# EAGLE design quadcopter (EAGLE 9.7.0)
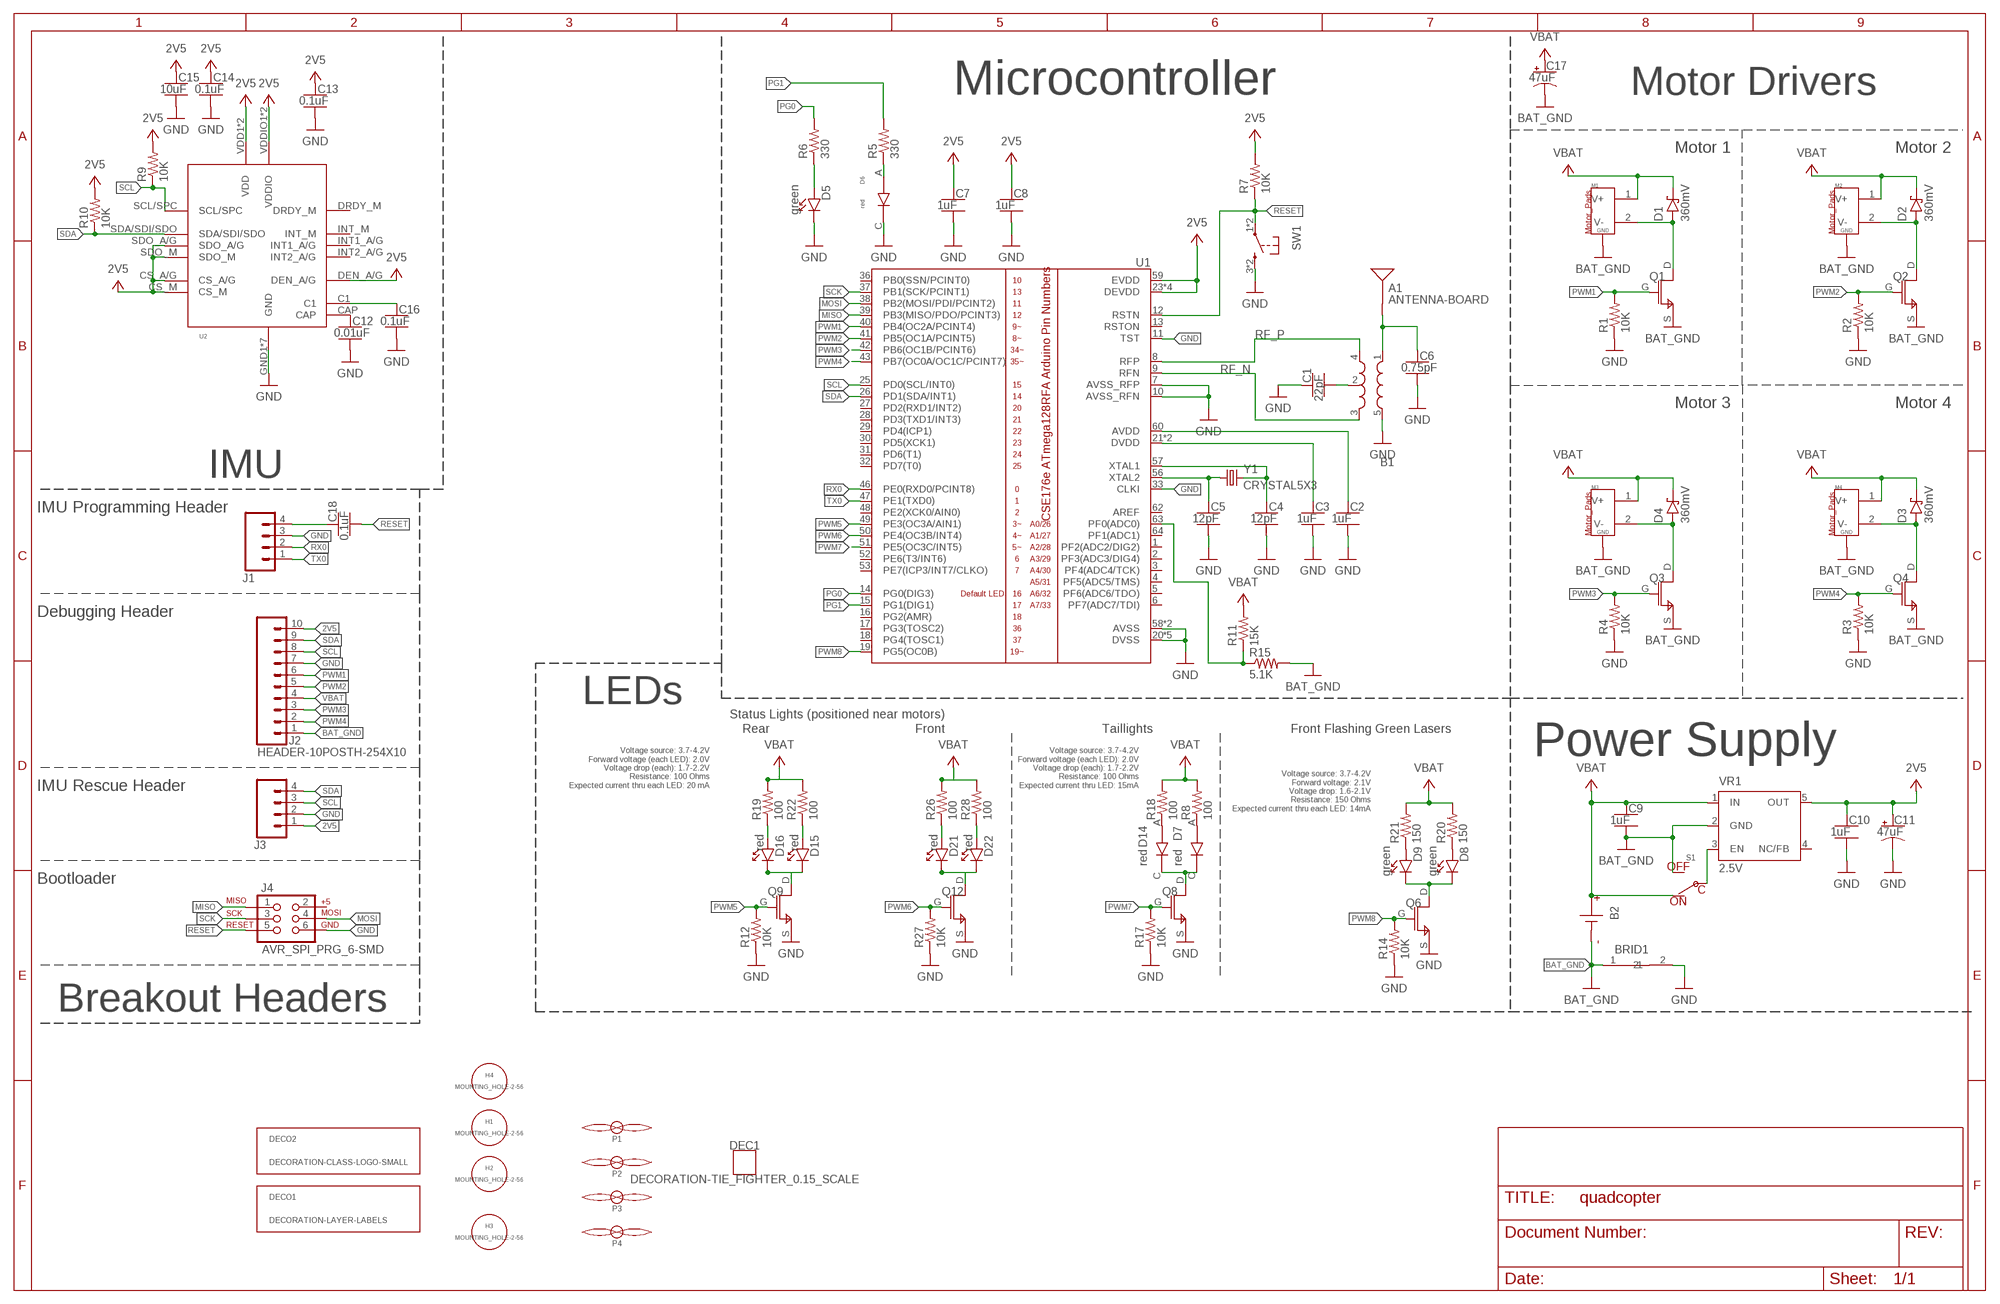
[diagram p0: schematic, sheet 1]
FRAME1 (FRAME_B_L): CREATOR: Unknown; DIST: Unknown; DISTPN: Unknown

## Parts
A1  ANTENNA-BOARD  [ANT_PCB_2.4GHZ_NRF8001_1.6MM_1OZ]
B1  BALUN0805  [BALUN]
B2  BATTERY-SMD-TH  [BATTERY-COMBO]
BRID1  NET_BRIDGE_5X5  [NET_BRIDGE_5X5]
C1  22pF  CAPACITOR-NP_SMD-2012-0805_CERAMIC-22PF  [CAPC2012X140_HS]
C2  1uF  CAPACITOR-NP_SMD-2012-0805_CERAMIC-1UF  [CAPC2012X140_HS]
C3  1uF  CAPACITOR-NP_SMD-2012-0805_CERAMIC-1UF  [CAPC2012X140_HS]
C4  12pF  CAPACITOR-NP_SMD-2012-0805_CERAMIC-12PF  [CAPC2012X140_HS]
C5  12pF  CAPACITOR-NP_SMD-2012-0805_CERAMIC-12PF  [CAPC2012X140_HS]
C6  0.75pF  CAPACITOR-NP_SMD-2012-0805_CERAMIC-0.75PF  [CAPC2012X140_HS]
C7  1uF  CAPACITOR-NP_SMD-2012-0805_CERAMIC-1UF  [CAPC2012X140_HS]
C8  1uF  CAPACITOR-NP_SMD-2012-0805_CERAMIC-1UF  [CAPC2012X140_HS]
C9  1uF  CAPACITOR-NP_SMD-2012-0805_CERAMIC-1UF  [CAPC2012X140_HS]
C10  1uF  CAPACITOR-NP_SMD-2012-0805_CERAMIC-1UF  [CAPC2012X140_HS]
C11  47uF  CAPACITOR-POL_47UF-SMD-1206-TAJA  [CAPMP3216X180]
C12  0.01uF  CAPACITOR-NP_SMD-2012-0805_CERAMIC-0.01UF  [CAPC2012X140_HS]
C13  0.1uF  CAPACITOR-NP_SMD-2012-0805_CERAMIC-0.1UF  [CAPC2012X140_HS]
C14  0.1uF  CAPACITOR-NP_SMD-2012-0805_CERAMIC-0.1UF  [CAPC2012X140_HS]
C15  10uF  CAPACITOR-NP_SMD-2012-0805_CERAMIC-10UF  [CAPC2012X140_HS]
C16  0.1uF  CAPACITOR-NP_SMD-2012-0805_CERAMIC-0.1UF  [CAPC2012X140_HS]
C17  47uF  CAPACITOR-POL_47UF-SMD-1206-TAJA  [CAPMP3216X180]
C18  0.1uF  CAPACITOR-NP_SMD-2012-0805_CERAMIC-0.1UF  [CAPC2012X140_HS]
D1  360mV  DIODE-SCHOTTKY_-SMD-SOD123  [SODFL3516X96]
D2  360mV  DIODE-SCHOTTKY_-SMD-SOD123  [SODFL3516X96]
D3  360mV  DIODE-SCHOTTKY_-SMD-SOD123  [SODFL3516X96]
D4  360mV  DIODE-SCHOTTKY_-SMD-SOD123  [SODFL3516X96]
D5  green  DIODE-LED_SMD-2012-0805-GREEN  [LEDSC125X200X120-2_HS]
D6  red  LED_RED-LTST-C170EKT  [LTST-C170EKT]
D7  red  LED_RED-LTST-C170EKT  [LTST-C170EKT]
D8  green  DIODE-LED_SMD-2012-0805-GREEN  [LEDSC125X200X120-2_HS]
D9  green  DIODE-LED_SMD-2012-0805-GREEN  [LEDSC125X200X120-2_HS]
D14  red  LED_RED-LTST-C170EKT  [LTST-C170EKT]
D15  red  LED-350-2312-1-ND-REVERSE  [1206_LED_REVERSE]
D16  red  LED-350-2312-1-ND-REVERSE  [1206_LED_REVERSE]
D21  red  LED-350-2312-1-ND-REVERSE  [1206_LED_REVERSE]
D22  red  LED-350-2312-1-ND-REVERSE  [1206_LED_REVERSE]
DEC1  DECORATION-TIE_FIGHTER_0.15_SCALE  [TIE_FIGHTER_0.15_SCALE]
DECO1  DECORATION-LAYER-LABELS  [LAYER_LABELS]
DECO2  DECORATION-CLASS-LOGO-SMALL  [QUADCLASS_LOGO_SMALL]
H1  MOUNTING_HOLE-2-56  [2-56-MOUNTING-HOLE-NO-METAL]
H2  MOUNTING_HOLE-2-56  [2-56-MOUNTING-HOLE-NO-METAL]
H3  MOUNTING_HOLE-2-56  [2-56-MOUNTING-HOLE-NO-METAL]
H4  MOUNTING_HOLE-2-56  [2-56-MOUNTING-HOLE-NO-METAL]
J1  HEADER-4POS-0.1IN-FEMALE-SMD-BOTTOM-ENTRY  [HEADER-1X4-BOTTOM-ENTRY]
J2  HEADER-10POSTH-254X10  [HDRV10W63P254_10X1_2540X254H838_HS]
J3  HEADER-4POS-0.1IN-FEMALE  [HDRVR4W80P254_1X4_1066X254X850B]
J4  AVR_SPI_PRG_6-SMD  [2X3-SMD]
M1  MOTOR_PADS_GND-MOLEX-SMD  [MOLEX-0532610271]
M2  MOTOR_PADS_GND-MOLEX-SMD  [MOLEX-0532610271]
M3  MOTOR_PADS_GND-MOLEX-SMD  [MOLEX-0532610271]
M4  MOTOR_PADS_GND-MOLEX-SMD  [MOLEX-0532610271]
P1  PROPELLOR-45MM  [MOTOR_AND_PROP]
P2  PROPELLOR-45MM  [MOTOR_AND_PROP]
P3  PROPELLOR-45MM  [MOTOR_AND_PROP]
P4  PROPELLOR-45MM  [MOTOR_AND_PROP]
Q1  N-MOSFET-SI2302DS  [SI2302DS]
Q2  N-MOSFET-SI2302DS  [SI2302DS]
Q3  N-MOSFET-SI2302DS  [SI2302DS]
Q4  N-MOSFET-SI2302DS  [SI2302DS]
Q6  N-MOSFET-SI2302DS  [SI2302DS]
Q8  N-MOSFET-SI2302DS  [SI2302DS]
Q9  N-MOSFET-SI2302DS  [SI2302DS]
Q12  N-MOSFET-SI2302DS  [SI2302DS]
R1  10K  RESISTOR_SMD-2012-0805-10K  [RESC2012X60_HS]
R2  10K  RESISTOR_SMD-2012-0805-10K  [RESC2012X60_HS]
R3  10K  RESISTOR_SMD-2012-0805-10K  [RESC2012X60_HS]
R4  10K  RESISTOR_SMD-2012-0805-10K  [RESC2012X60_HS]
R5  330  RESISTOR_SMD-2012-0805-330  [RESC2012X60_HS]
R6  330  RESISTOR_SMD-2012-0805-330  [RESC2012X60_HS]
R7  10K  RESISTOR_SMD-2012-0805-10K  [RESC2012X60_HS]
R8  100  RESISTOR_SMD-2012-0805-100  [RESC2012X60_HS]
R9  10K  RESISTOR_SMD-2012-0805-10K  [RESC2012X60_HS]
R10  10K  RESISTOR_SMD-2012-0805-10K  [RESC2012X60_HS]
R11  15K  RESISTOR_SMD-2012-0805-15K  [RESC2012X60_HS]
R12  10K  RESISTOR_SMD-2012-0805-10K  [RESC2012X60_HS]
R14  10K  RESISTOR_SMD-2012-0805-10K  [RESC2012X60_HS]
R15  5.1K  RESISTOR_SMD-2012-0805-5.1K  [RESC2012X60_HS]
R17  10K  RESISTOR_SMD-2012-0805-10K  [RESC2012X60_HS]
R18  100  RESISTOR_SMD-2012-0805-100  [RESC2012X60_HS]
R19  100  RESISTOR_SMD-2012-0805-100  [RESC2012X60_HS]
R20  150  RESISTOR_SMD-2012-0805-150  [RESC2012X60_HS]
R21  150  RESISTOR_SMD-2012-0805-150  [RESC2012X60_HS]
R22  100  RESISTOR_SMD-2012-0805-100  [RESC2012X60_HS]
R26  100  RESISTOR_SMD-2012-0805-100  [RESC2012X60_HS]
R27  10K  RESISTOR_SMD-2012-0805-10K  [RESC2012X60_HS]
R28  100  RESISTOR_SMD-2012-0805-100  [RESC2012X60_HS]
S1  POWER-SWITCH-MFS201N-9-Z-SMD-EDGE  [JS102011SAQN]
SW1  PUSHBUTTON_-4.5X4.5  [4.5MM_TACTILE_SWITCH_TL3305AF160QG]
U1  ATMEGA128RFA1  [QFN-64]
U2  IMU_LSM9DS1-LSM9DS1  [LSM9DS1]
VR1  2.5V  TPS73633-DBVT2.5V  [SOT23-DBV]
Y1  CRYSTAL5X3  [CRYSTAL-SMD-5X3]

## Nets
2V5 [PWR]: C7.1 C8.1 C10.1 C11.1(+) C13.1 C14.1 C15.1 J2.10 J3.1 R7.2 R9.2 R10.2 U1.23(DEVDD) U1.34(DEVDD) U1.44(DEVDD) U1.54(DEVDD) U1.59(EVDD) U2.CS_A/G U2.CS_M U2.DEN_A/G U2.SDO_A/G U2.SDO_M U2.VDD1(VDD) U2.VDD2(VDD) U2.VDDIO1(VDDIO) U2.VDDIO2(VDDIO) VR1.5(OUT)
ANTENNA [RFSIG]: A1.FEED(SIGNAL) B1.1(IN) C6.1
BAT_GND [HIGHCURRENT]: B2.2(N) B2.G2(N) B2.G3(N) B2.G(N) BRID1.1 C9.2 C17.2(-) J2.1 M1.G1(GND) M1.G2(GND) M2.G1(GND) M2.G2(GND) M3.G1(GND) M3.G2(GND) M4.G1(GND) M4.G2(GND) Q1.S Q2.S Q3.S Q4.S R15.2 S1.A(OFF) VR1.2(GND)
GND [PWR]: B1.5(GND) BRID1.2 C1.1 C2.2 C3.2 C4.2 C5.2 C6.2 C7.2 C8.2 C10.2 C11.2(-) C12.2 C13.2 C14.2 C15.2 C16.2 D5.C D6.C J1.3 J2.7 J3.2 J4.6 Q6.S Q8.S Q9.S Q12.S R1.1 R2.1 R3.1 R4.1 R12.1 R14.1 R17.1 R27.1 SW1.3 SW1.4 U1.7(AVSS_RFP) U1.10(AVSS_RFN) U1.11(TST) U1.20(DVSS) U1.24(DVSS) U1.33(CLKI) U1.35(DVSS) U1.45(DVSS) U1.55(DVSS) U1.58(AVSS) U1.61(AVSS) U2.GND1(GND) U2.GND2(GND) U2.RES1(GND) U2.RES2(GND) U2.RES3(GND) U2.RES4(GND) U2.RES5(GND)
MISO: J4.1 U1.39(PB3(MISO/PDO/PCINT3))
MOSI: J4.4 U1.38(PB2(MOSI/PDI/PCINT2))
N$1 [HIGHCURRENT]: D2.2(A) M2.2(V-) Q2.D
N$2 [HIGHCURRENT]: D1.2(A) M1.2(V-) Q1.D
N$3 [HIGHCURRENT]: D4.2(A) M3.2(V-) Q3.D
N$4 [HIGHCURRENT]: D3.2(A) M4.2(V-) Q4.D
N$5: D6.A R5.1
N$6: C18.1 J1.4
N$7: B1.2(GND) C1.2
N$8: C2.1 U1.60(AVDD)
N$9: C3.1 U1.21(DVDD) U1.22(DVDD)
N$10: C5.1 U1.56(XTAL2) Y1.1
N$11: C4.1 U1.57(XTAL1) Y1.3
N$13: D5.A R6.1
N$16: C12.1 U2.CAP
N$17: D8.C D9.C Q6.D
N$18: D14.A R18.1
N$19: D8.A R20.1
N$20: D9.A R21.1
N$21: D7.A R8.1
N$22: C16.1 U2.C1
N$23: S1.C VR1.3(EN)
N$26: D16.2(A) R19.1
N$27: D7.C D14.C Q8.D
N$28: R11.1 R15.1 U1.63(PF0(ADC0))
N$34: D15.2(A) R22.1
N$35: D15.1(C) D16.1(C) Q9.D
N$40: D21.1(C) D22.1(C) Q12.D
N$42: D21.2(A) R26.1
N$43: D22.2(A) R28.1
PG0: R6.2 U1.14(PG0(DIG3))
PG1: R5.2 U1.15(PG1(DIG1))
PWM1: J2.6 Q1.G R1.2 U1.40(PB4(OC2A/PCINT4))
PWM2: J2.5 Q2.G R2.2 U1.41(PB5(OC1A/PCINT5))
PWM3: J2.3 Q3.G R4.2 U1.42(PB6(OC1B/PCINT6))
PWM4: J2.2 Q4.G R3.2 U1.43(PB7(OC0A/OC1C/PCINT7))
PWM5: Q9.G R12.2 U1.49(PE3(OC3A/AIN1))
PWM6: Q12.G R27.2 U1.50(PE4(OC3B/INT4))
PWM7: Q8.G R17.2 U1.51(PE5(OC3C/INT5))
PWM8: Q6.G R14.2 U1.19(PG5(OC0B))
RESET: C18.2 J4.5 R7.1 SW1.1 SW1.2 U1.12(RSTN)
RF_N: B1.3(OUT2) U1.9(RFN)
RF_P: B1.4(OUT1) U1.8(RFP)
RX0: J1.2 U1.46(PE0(RXD0/PCINT8))
SCK: J4.3 U1.37(PB1(SCK/PCINT1))
SCL: J2.8 J3.3 R9.1 U1.25(PD0(SCL/INT0)) U2.SCL/SPC
SDA: J2.9 J3.4 R10.1 U1.26(PD1(SDA/INT1)) U2.SDA/SDI/SDO
TX0: J1.1 U1.47(PE1(TXD0))
VBAT [HIGHCURRENT]: B2.1(P) B2.P C9.1 C17.1(+) D1.1(C) D2.1(C) D3.1(C) D4.1(C) J2.4 M1.1(V+) M2.1(V+) M3.1(V+) M4.1(V+) R8.2 R11.2 R18.2 R19.2 R20.2 R21.2 R22.2 R26.2 R28.2 S1.B(ON) VR1.1(IN)
Unconnected: J4.2 U1.1(PF2(ADC2/DIG2)) U1.2(PF3(ADC3/DIG4)) U1.3(PF4(ADC4/TCK)) U1.4(PF5(ADC5/TMS)) U1.5(PF6(ADC6/TDO)) U1.6(PF7(ADC7/TDI)) U1.13(RSTON) U1.16(PG2(AMR)) U1.17(PG3(TOSC2)) U1.18(PG4(TOSC1)) U1.27(PD2(RXD1/INT2)) U1.28(PD3(TXD1/INT3)) U1.29(PD4(ICP1)) U1.30(PD5(XCK1)) U1.31(PD6(T1)) U1.32(PD7(T0)) U1.36(PB0(SSN/PCINT0)) U1.48(PE2(XCK0/AIN0)) U1.52(PE6(T3/INT6)) U1.53(PE7(ICP3/INT7/CLKO)) U1.62(AREF) U1.64(PF1(ADC1)) U2.DRDY_M U2.INT1_A/G U2.INT2_A/G U2.INT_M VR1.4(NC/FB)

## Notes on the sheet
- Microcontroller | Motor Drivers
- Motor 1 | Motor 2
- Motor 3 | Motor 4
- IMU
- IMU Programming Header
- Debugging Header
- LEDs
- Status Lights (positioned near motors)
- Rear | Front | Taillights | Front Flashing Green Lasers
- Power Supply
- Voltage source: 3.7-4.2V
  Forward voltage (each LED): 2.0V
  Voltage drop (each): 1.7-2.2V
  Resistance: 100 Ohms
  Expected current thru each LED: 20 mA
- Voltage source: 3.7-4.2V
  Forward voltage (each LED): 2.0V
  Voltage drop (each): 1.7-2.2V
  Resistance: 100 Ohms
  Expected current thru LED: 15mA
- IMU Rescue Header
- Voltage source: 3.7-4.2V
  Forward voltage: 2.1V
  Voltage drop: 1.6-2.1V
  Resistance: 150 Ohms
  Expected current thru each LED: 14mA
- Bootloader
- Breakout Headers

## Library data of the parts
A1 = quadparts_prebuilt_2022:ANTENNA: Single endded antenna.; CREATOR: Swanson; DESC: trace antenna; DIST: NA; DISTPN: NA; MFR: NA; MOUNTING: NONE; MPN: NA; POPULATE: NO
B1 = quadparts_prebuilt_2022:BALUN: A balun to convert differential radio-frequency outputs from the microcontroller into a single-ended driver for the antenna.; CREATOR: Swanson; DATASHEET: http://katalog.we-online.de/pbs/datasheet/748421245.pdf; DESC: BALUN 2.4GHZ-2.5GHZ 50/100 0805; DIST: Digikey; DISTPN: 732-2230-1-ND; MFR: Wurth Electronics Inc.; MOUNTING: SMD; MPN: 748421245; PACKAGE: 0805; PRICE: 2.63; REVIEWER: Swanson
B2 = quadparts_prebuilt_2022:BATTERY: Connections for a battery.
BRID1 = custom_michael_shao:NET_BRIDGE; CREATOR: Michael Shao; DIST: N/A; DISTPN: N/A
C1 = quadparts_prebuilt_2022:CAPACITOR-NP_: Nonpolarized capacitor; CREATOR: Swanson; DESC: CAP CER 22PF 250V C0G/NP0 0805; DIST: Digikey; DISTPN: 490-5534-1-ND; MFR: Murata Electronics; MOUNTING: SMD; MPN: GRM21A5C2E220JW01D; PACKAGE: 0805; REVIEWER: Swanson
C2 C3 C7-C10 = quadparts_prebuilt_2022:CAPACITOR-NP_: Nonpolarized capacitor; CREATOR: Swanson; DIST: Digikey; DISTPN: 587-1281-1-ND; MFR: Taiyo Yuden; MOUNTING: SMD; MPN: TMK212B7105KG-T; REVIEWER: Swanson
C4 C5 = quadparts_prebuilt_2022:CAPACITOR-NP_: Nonpolarized capacitor; CREATOR: Swanson; DESC: CAP CER 12PF 250V C0G/NP0 0805; DIST: Digikey; DISTPN: 490-5531-1-ND; MFR: Murata Electronics; MOUNTING: SMD; MPN: GRM21A5C2E120JW01D; PACKAGE: 0805; REVIEWER: Swanson
C6 = quadparts_prebuilt_2022:CAPACITOR-NP_: Nonpolarized capacitor; CREATOR: Swanson; DESC: CAP CER 0.75PF 100V C0G/NP0 0805; DIST: Digikey; DISTPN: 490-3585-1-ND; MFR: Murata Electronics; MOUNTING: SMD; MPN: GQM2195C2AR75CB01D; PACKAGE: 0805; REVIEWER: Swanson
C11 C17 = quadparts_prebuilt_2022:CAPACITOR-POL_: Polarized capacitor; CREATOR: Swanson; DESC: CAP TANT 47UF 10% 6.3V 1206; DIST: DIGIKEY; DISTPN: 478-11462-1-ND; MFR: AVX Corporation; MOUNTING: SMD; MPN: TAJA476K006SNJV; PACKAGE: 1206
C12 = quadparts_prebuilt_2022:CAPACITOR-NP_: Nonpolarized capacitor; CREATOR: Swanson; DIST: Digikey; DISTPN: 1608-1458-1-ND; MFR: Knowles Syfer; MOUNTING: SMD; MPN: 0805J0500104KJT; REVIEWER: Swanson
C13 C14 C16 C18 = quadparts_prebuilt_2022:CAPACITOR-NP_: Nonpolarized capacitor; CREATOR: Swanson; DESC: CAP CER 0.1UF 100V X7R 0805; DIST: Digikey; DISTPN: 445-1418-1-ND; MFR: TDK Corporation; MOUNTING: SMD; MPN: C2012X7R2A104K125AA; PACKAGE: 0805; REVIEWER: Swanson
C15 = quadparts_prebuilt_2022:CAPACITOR-NP_: Nonpolarized capacitor; CREATOR: Swanson; DESC: CAP CER 10UF 25V X5R 0805; DIST: Digikey; DISTPN: 445-5984-1-ND; MFR: TDK; MOUNTING: SMD; MPN: C2012X5R1E106K125AB; REVIEWER: Swanson
D1-D4 = quadparts_prebuilt_2022:DIODE-SCHOTTKY_: Schottky diode; CREATOR: Swanson; DESC: DIODE SCHOTTKY 30V 1.5A SFLAT; DIST: Digikey; DISTPN: CRS08QMCT-ND; MFR: Toshiba Semiconductor and Storage; MOUNTING: SMD; MPN: CRS08(TE85L,Q,M); REVIEWER: Swanson
D5 D8 D9 = quadparts_prebuilt_2022:DIODE-LED_: Light emitting diode; CREATOR: Swanson; DIST: Digikey; DISTPN: 160-1179-1-ND; MFR: Lite-On Inc; MOUNTING: SMD; MPN: LTST-C170GKT; REVIEWER: Swanson
D6 D7 D14 = custom_michael_shao:LED; CREATOR: Michael Shao; DIST: Digikey; DISTPN: 160-1178-1-ND
D15 D16 D21 D22 = LED:LED; CREATOR: Evan Smith; DIST: Digikey; DISTPN: 350-2312-1-ND
DEC1 = custom_michael_shao:DECORATION; CREATOR: Evan Smith; DIST: NA; DISTPN: NA
DECO1 DECO2 = quadparts_prebuilt_2022:DECORATION
H1-H4 = quadparts_prebuilt_2022:MOUNTING_HOLE
J1 = quadparts_prebuilt_2022:HEADER-4POS; CREATOR: Swanson; DESC: CONN RCPT 4POS 0.1 GOLD SMD; DIST: DIGIKEY; DISTPN: A121787CT-ND; MFR: TE Connectivity AMP Connectors; MOUNTING: SMD; MPN: 1241152-4
J2 = quadparts_prebuilt_2022:HEADER-10POS: 10 pin single inline pin header, socket, or connector; CREATOR: Swanson; DATASHEET: http://portal.fciconnect.com/Comergent//fci/drawing/68000.pdf; DIST: Digikey; DISTPN: 609-3250-ND; MFR: Amphenol FCI; MOUNTING: TH; MPN: 68000-110HLF; PRICE: 0.55; REVIEWER: Swanson
J3 = quadparts_prebuilt_2022:HEADER-4POS; CREATOR: Swanson; DIST: Digikey; DISTPN: S7002-ND
J4 = quadparts_prebuilt_2022:AVR_SPI_PRG_6: AVR ISP 6 Pin This is the in-system programming (ISP) connector for Atmel Microcontrollers programming.; CREATOR: Swanson; DESC: CONN HEADER SMD 6POS 2.54MM; DIST: Digikey; DISTPN: 609-3487-2-ND; MFR: Amphenol ICC (FCI); MOUNTING: SMD; MPN: 95278-101A06LF
M1-M4 = quadparts_prebuilt_2022:MOTOR_PADS_GND: Connections a brushed motor.; CREATOR: Swanson; DESC: CONN HEADER SMD R/A 2POS 1.25MM; DIST: DIGIKEY; DISTPN: WM7620CT-ND; MFR: Molex; MOUNTING: SMD; MPN: 532610271
P1-P4 = quadparts_prebuilt_2022:PROPELLOR
Q1-Q4 Q6 Q8 Q9 Q12 = custom_michael_shao:N-MOSFET; CREATOR: Michael Shao; DIST: Digikey; DISTPN: SI2302CDS-T1-E3CT-ND
R1-R4 R7 R9 R10 R12 R14 R17 R27 = quadparts_prebuilt_2022:RESISTOR_: Resistor; CREATOR: Swanson; DESC: RES SMD 10K OHM 5% 1/8W 0805; DIST: Digikey; DISTPN: 311-10KARCT-ND; MFR: Yageo; MOUNTING: SMD; MPN: RC0805JR-0710KL; PACKAGE: 0805; REVIEWER: Swanson
R5 R6 = quadparts_prebuilt_2022:RESISTOR_: Resistor; CREATOR: Swanson; DIST: Digikey; DISTPN: 311-330ARCT-ND; MFR: Yageo; MOUNTING: SMD; MPN: RC0805JR-07330RL; REVIEWER: Swanson
R8 R18 R19 R22 R26 R28 = quadparts_prebuilt_2022:RESISTOR_: Resistor; CREATOR: Swanson; DIST: Digikey; DISTPN: 311-100ARCT-ND; MFR: Yageo; MOUNTING: SMD; MPN: RC0805JR-07100RL; REVIEWER: Swanson
R11 = quadparts_prebuilt_2022:RESISTOR_: Resistor; CREATOR: SWANSON; DIST: DIGIKEY; DISTPN: YAG3695CT-ND; MOUNTING: SMD
R15 = quadparts_prebuilt_2022:RESISTOR_: Resistor; CREATOR: Swanson; DIST: Digikey; DISTPN: 311-5.1KARCT-ND; MFR: Yageo; MOUNTING: SMD; MPN: RC0805JR-075K1L; REVIEWER: Swanson
R20 R21 = quadparts_prebuilt_2022:RESISTOR_: Resistor; CREATOR: Swanson; DIST: Digikey; DISTPN: YAG3694CT-ND; MOUNTING: SMD; REVIEWER: Swanson
S1 = quadparts_prebuilt_2022:POWER-SWITCH-MFS201N-9-Z; CREATOR: Swanson; DESC: SWITCH SLIDE SPDT 300MA 6V; DIST: DIGIKEY; DISTPN: 401-1999-1-ND; MFR: C&K; MOUNTING: SMD; MPN: JS102011SAQN
SW1 = quadparts_prebuilt_2022:PUSHBUTTON_: "Tactile" or "clicky" button.; CREATOR: Swanson; DESC: SWITCH TACTILE SPST-NO 50MA 12V; DIST: DIGIKEY; DISTPN: EG5350CT-ND; MFR: E-Switch; MOUNTING: SMD; MPN: TL3305AF160QG
U1 = quadparts_prebuilt_2022:ATMEGA128RFA1: ATmega128RFA1 8-bit AVR Microcontroller with Low Power 2.4GHz Transceiver for ZigBee and IEEE 802.15.4; CREATOR: Swanson; DATASHEET: http://www.atmel.com/Images/Atmel-8266-MCU_Wireless-ATmega128RFA1_Datasheet.pdf; DESC: IC RF TXRX+MCU 802.15.4 64VFQFN; DIST: Digikey; DISTPN: ATMEGA128RFA1-ZU-ND; MFR: Microchip Technology; MOUNTING: SMD; MPN: ATMEGA128RFA1-ZU; PACKAGE: QFN; PRICE: 10.21; REVIEWER: Swanson
U2 = custom_michael_shao:IMU_LSM9DS1; CREATOR: Michael Shao; DIST: Digikey; DISTPN: 497-14946-1-ND
VR1 = quadparts_prebuilt_2022:TPS73633-DBVT: LP3985-series voltage regulators.; CREATOR: Swanson; DATASHEET: http://www.ti.com/lit/ds/symlink/lp3985.pdf; DESC: IC REG LINEAR 2.5V 150MA SOT23-5; DIST: Digikey; DISTPN: LP3985IM5X-2.5/NOPBCT-ND; MFR: Texas Instruments; MOUNTING: SMD; MPN: LP3985IM5X-2.5/NOPB; REVIEWER: Swanson
Y1 = quadparts_prebuilt_2022:CRYSTAL: Crystals to provide clock references for microcontrollers, etc.; CREATOR: Swanson; DATASHEET: http://www.abracon.com/Resonators/abm3b.pdf; DESC: CRYSTAL 16.0000MHZ 18PF SMD; DIST: Digikey; DISTPN: 535-9122-1-ND; MFR: Abracon LLC; MOUNTING: SMD; MPN: ABM3B-16.000MHZ-B2-T; PRICE: 0.68; PROD_ID: XTAL-08218; REVIEWER: Swanson

## Net classes
1 RFSIG: width 1.27 mm
2 PWR: width 0.254 mm
3 HIGHCURRENT: width 0.762 mm, drill 0.61 mm

## Board
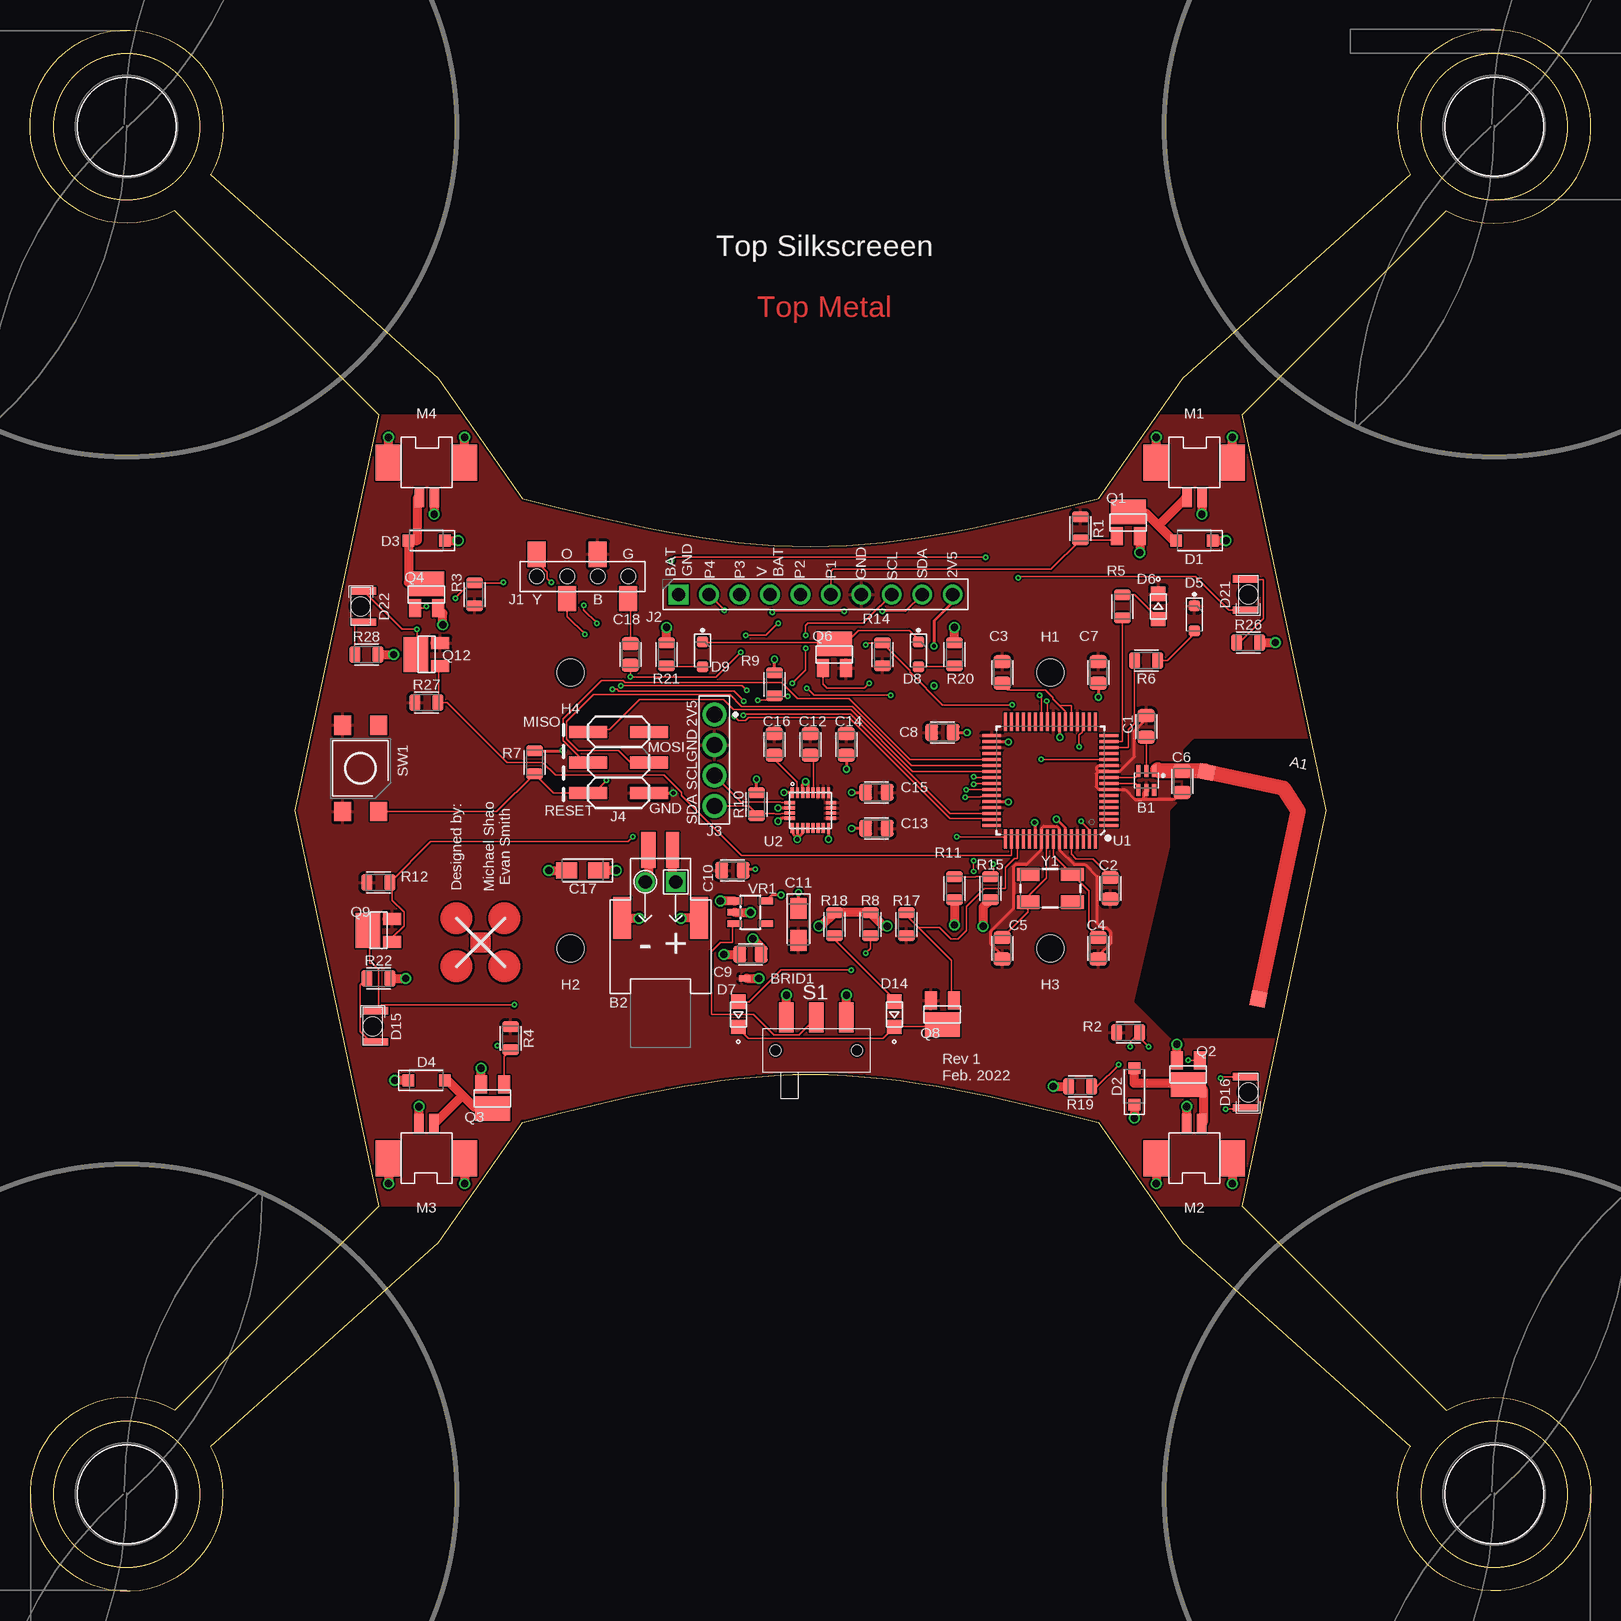
[diagram p1: board, top side]
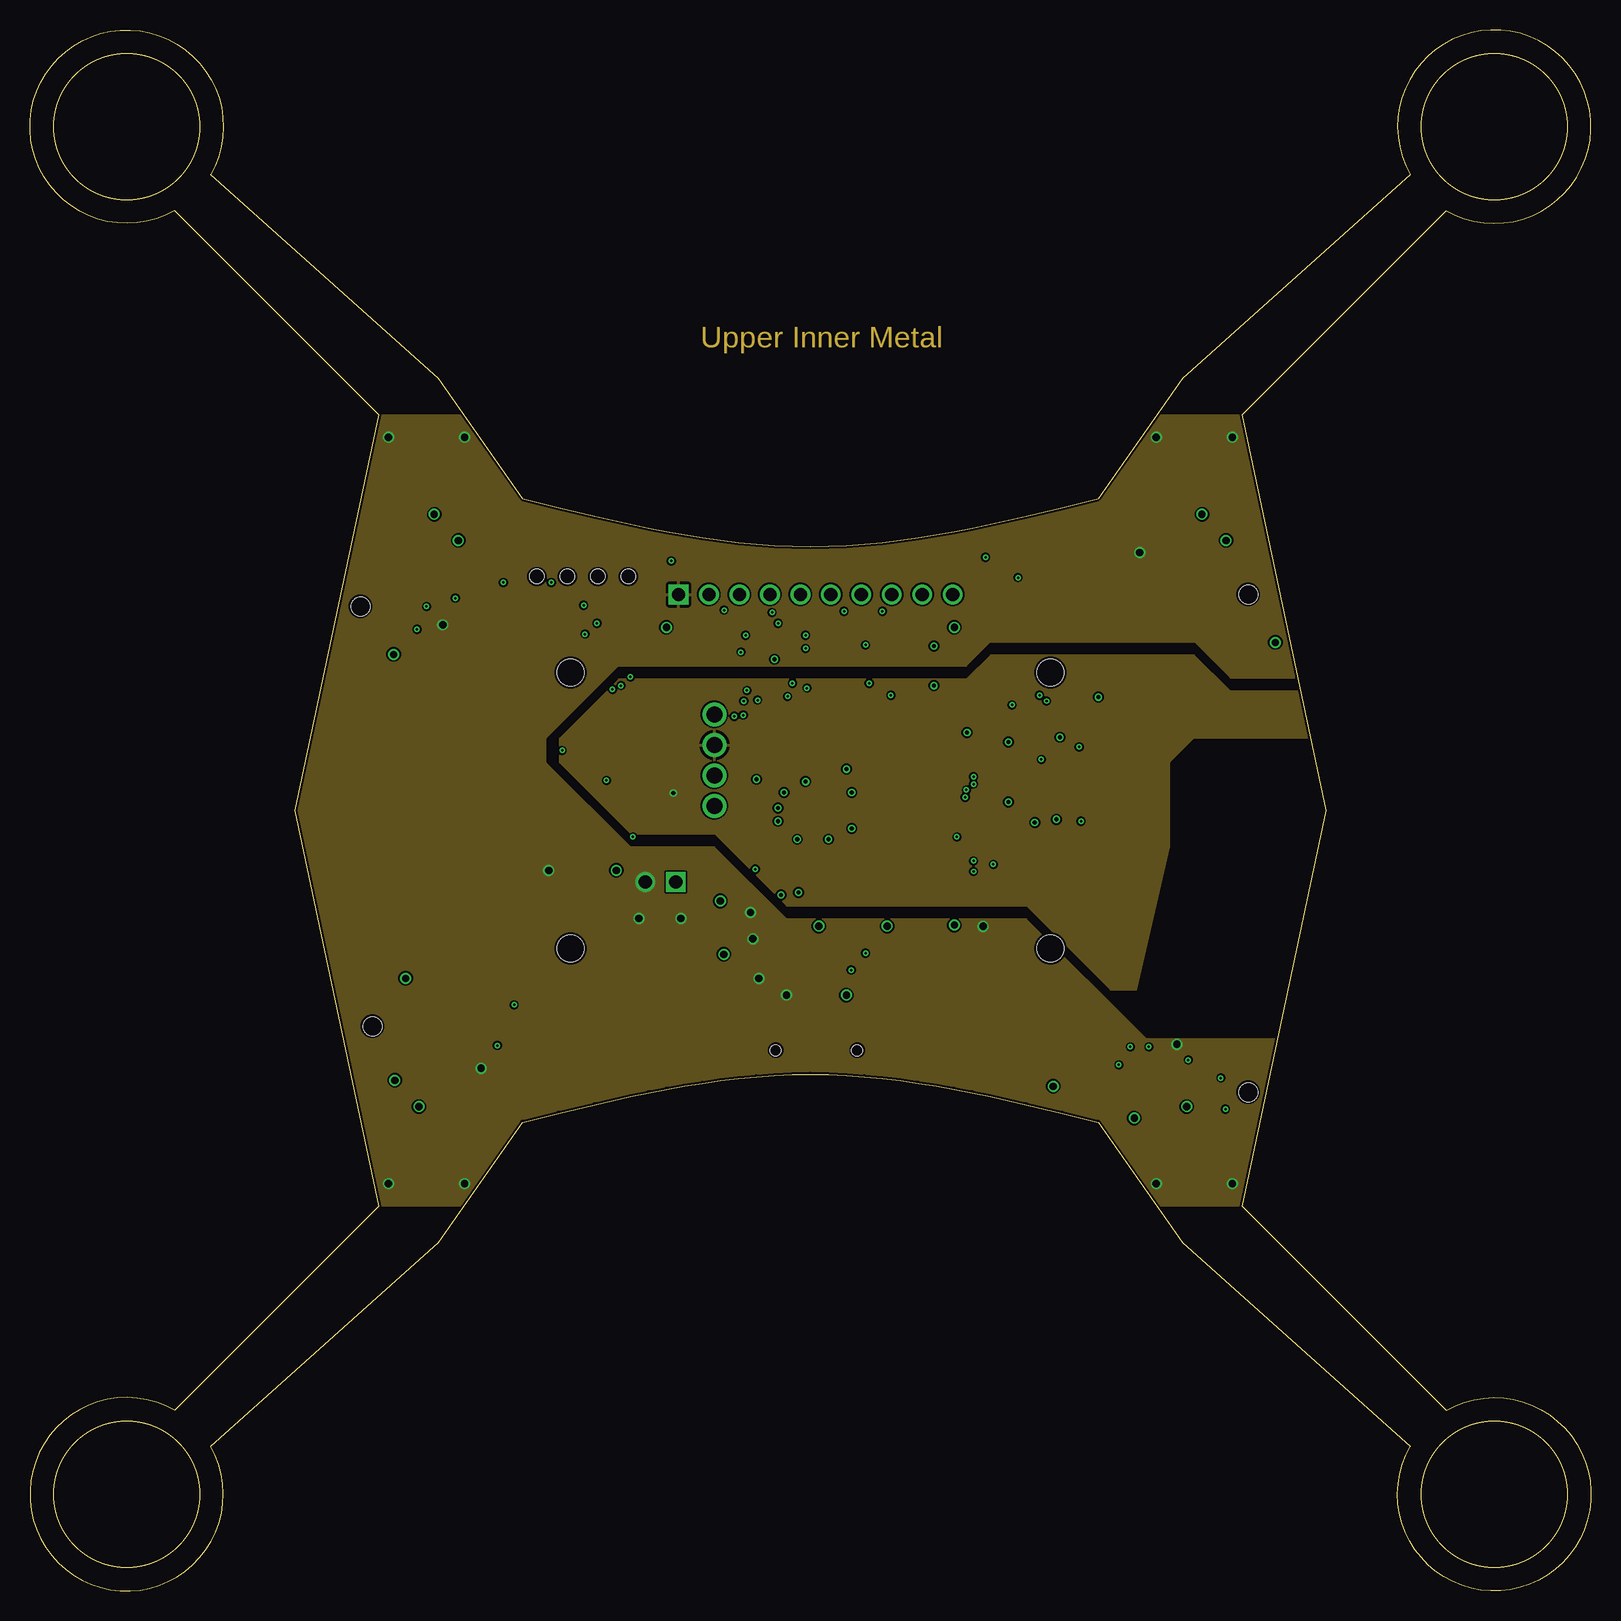
[diagram p2: board, inner layer Route2]
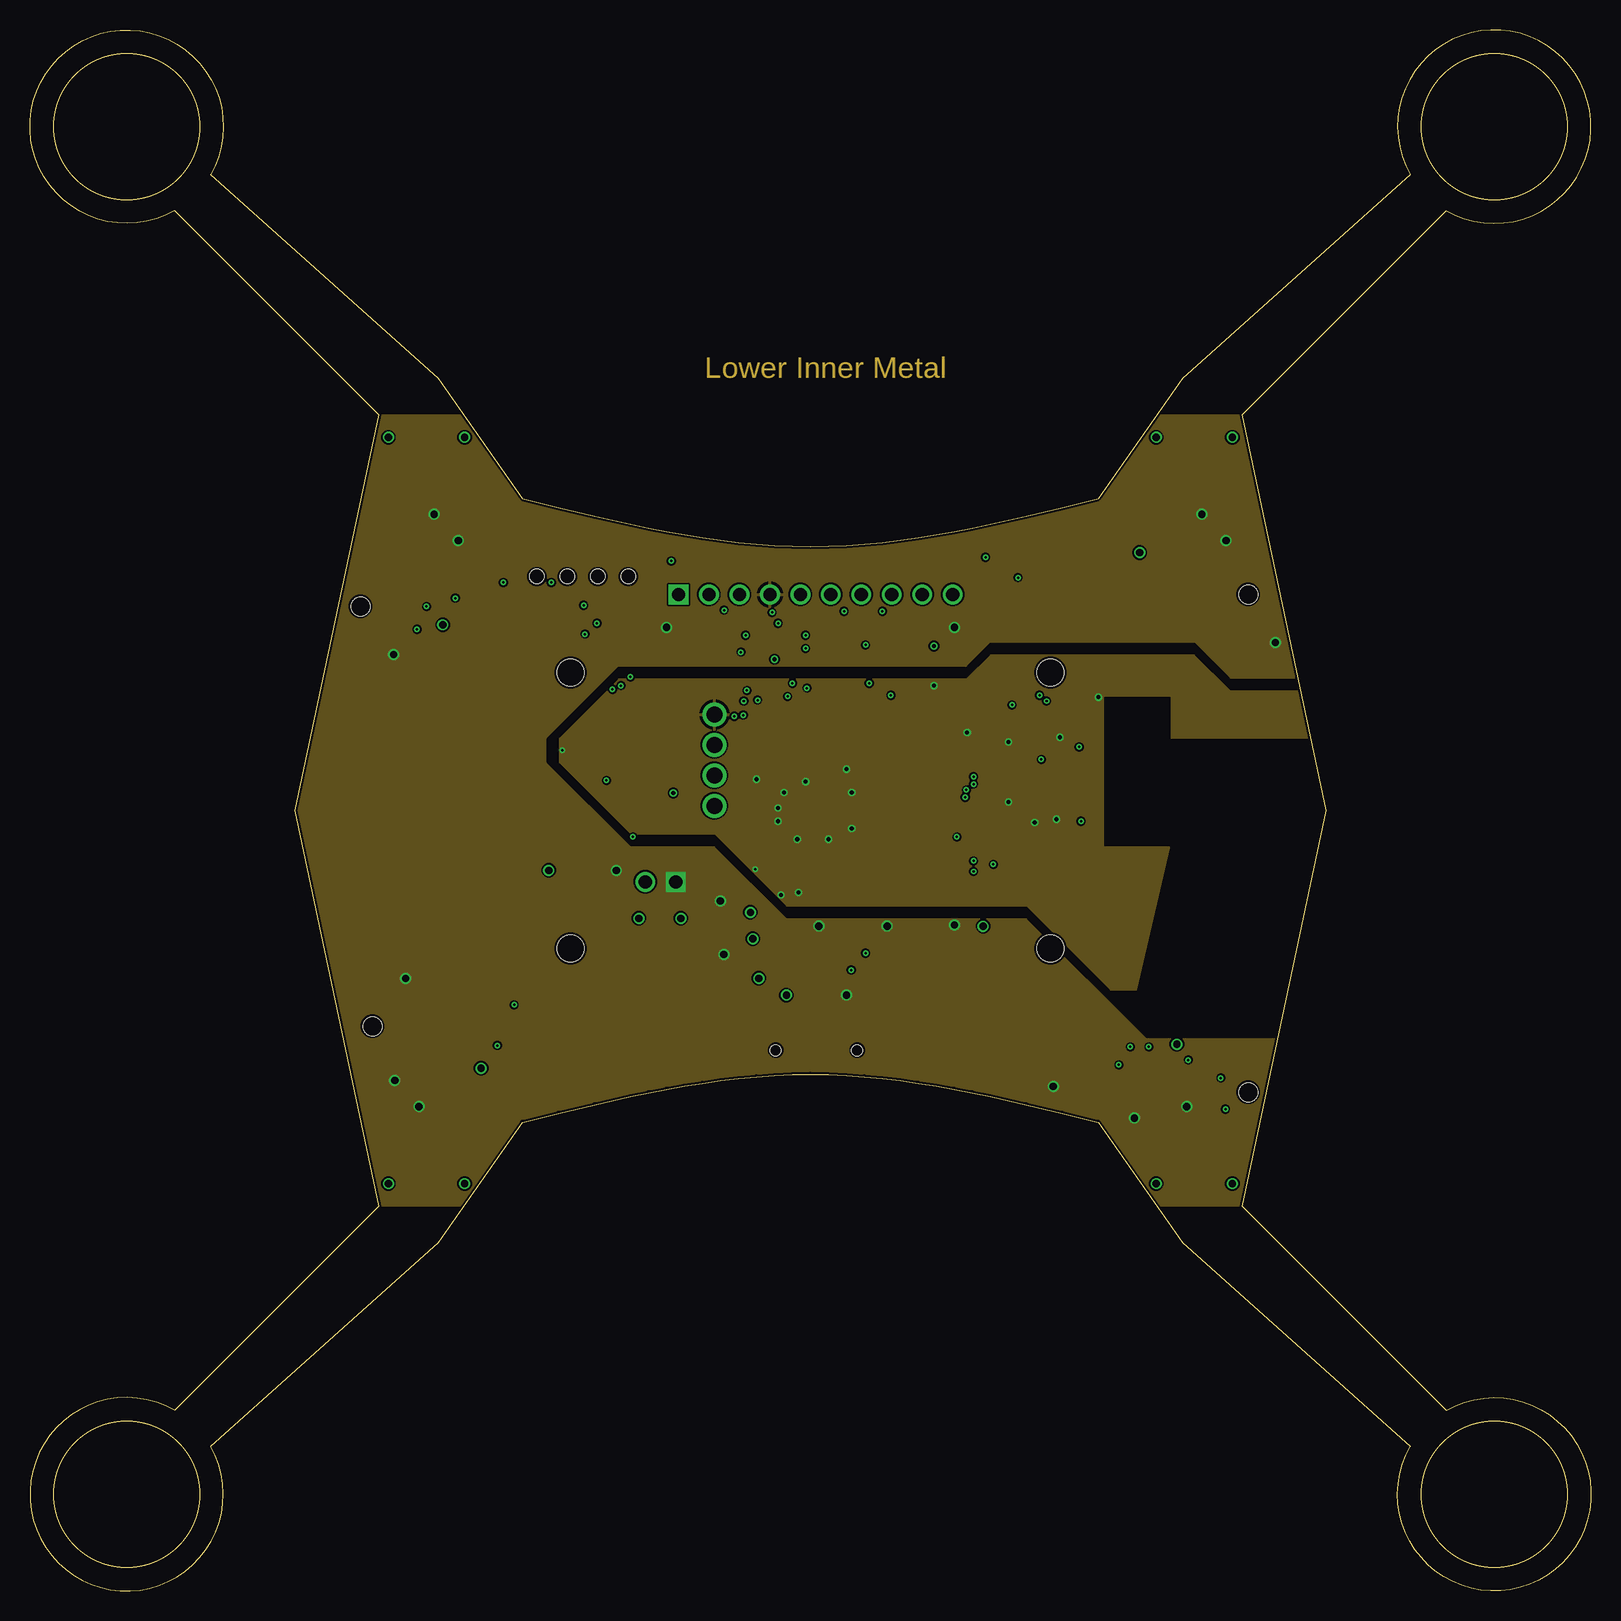
[diagram p3: board, inner layer Route15]
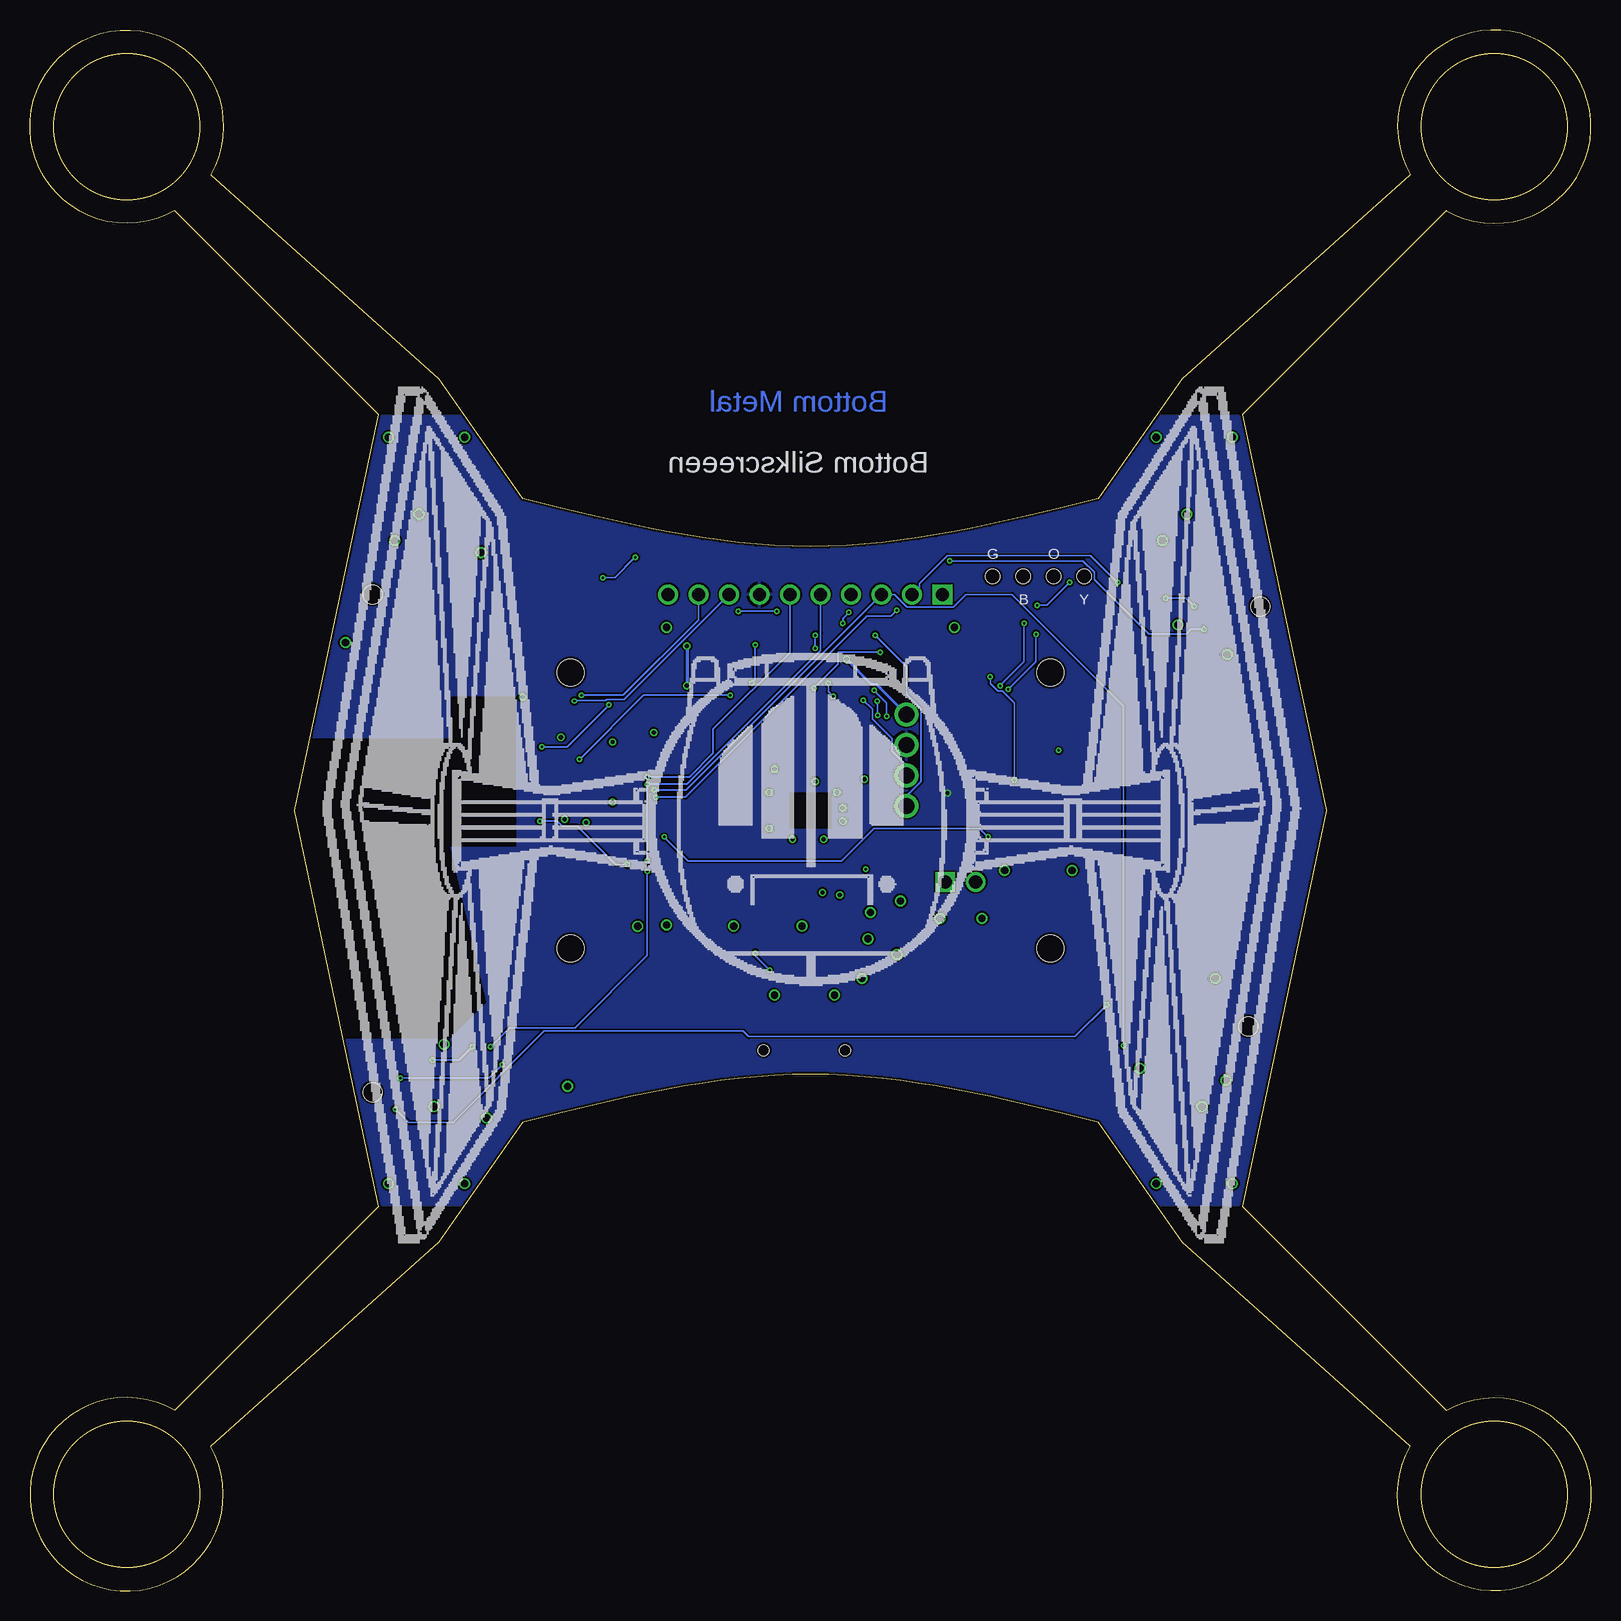
[diagram p4: board, bottom side, seen from below]

Size 130.11 x 130.11 mm. Coordinates in mm from the lower left corner, seen from the top.
Outline: 34.06,29.06 41.06,39.06 44.06,39.8 47.06,40.53 50.06,41.2 51.56,41.51 53.06,41.81 54.56,42.08 56.06,42.32 57.56,42.53 59.06,42.71 60.56,42.86 62.06,42.97 63.56,43.03 65.06,43.06 66.56,43.03 68.06,42.97 69.56,42.86 71.06,42.71 72.56,42.53 74.06,42.32 75.56,42.08 77.06,41.81 78.56,41.51 80.06,41.2 83.06,40.53 86.06,39.8 89.06,39.06 96.06,29.06 115.06,12.06 arc329 118.06,15.06 101.06,32.06 108.06,65.06 101.06,98.06 118.06,115.06 arc329 115.06,118.06 96.06,101.06 89.06,91.06 86.06,90.31 83.06,89.59 80.06,88.91 78.56,88.6 77.06,88.31 75.56,88.04 74.06,87.79 72.56,87.58 71.06,87.4 69.56,87.25 68.06,87.15 66.56,87.08 65.06,87.06 63.56,87.08 62.06,87.15 60.56,87.25 59.06,87.4 57.56,87.58 56.06,87.79 54.56,88.04 53.06,88.31 51.56,88.6 50.06,88.91 47.06,89.59 44.06,90.31 41.06,91.06 34.06,101.06 15.06,118.06 arc329 12.06,115.06 29.06,98.06 22.06,65.06 29.06,32.06 12.06,15.06 arc329 15.06,12.06 34.06,29.06
Outline: circle at 8.06,8.06 radius 6.1
Outline: circle at 8.06,122.06 radius 6.1
Outline: circle at 122.06,122.06 radius 6.1
Outline: circle at 122.06,8.06 radius 6.1
Copper layers (1*2*15*16): Top 0.035559375mm / dielectric 1.501140625mm / Route2 0.035559375mm / dielectric 0.149859375mm / Route15 0.035559375mm / dielectric 0.200659375mm / Bottom 0.035559375mm
Design rules "pcbcart-4layer-5mil-small-cream": minimum track width 5mil, minimum drill 8mil, track to track 6mil, track to pad 6mil, pad to pad 6mil, via to via 6mil, smd to smd 6mil, copper to edge 0.2mm, drill to drill 10mil, minimum pad ring 5mil, minimum via ring 5mil, stop-mask expansion 3mil, vias tented up to drill 0.45mm, thermal gap 10mil

### Footprints (pad centres in the part's own frame; a part is rotated, then mirrored left to right if it is on the bottom)
ANT_PCB_2.4GHZ_NRF8001_1.6MM_1OZ = smd 1.27 x 1.27: FEED 0,0; TESTPOINT -8.169,17.605
BALUN = smd 0.35 x 1: 1 -0.65,-0.8; 2 0,-0.8; 3 0.65,-0.8; 4 0.65,0.8; 5 0,0.8; 6 -0.65,0.8
BATTERY-COMBO = drill 1.1 square: 1 1.27,2.54 | drill 1.1: 2 -1.27,2.54 | smd 1.2 x 3: G -1,5.2 | smd 1.5 x 3.5: G2 -3.2,-0.45; G3 3.2,-0.45 | smd 1.1 x 3: P 1,5.2
NET_BRIDGE_5X5 = smd 0.5 x 0.5: 1 -0.2,0; 2 0.2,0
CAPC2012X140_HS = smd 1.08 x 1.42: 1 -0.895,0; 2 0.895,0
CAPMP3216X180 = smd 1.735 x 1.315: 1 -1.34,0; 2 1.34,0
SODFL3516X96 = smd 0.962 x 1.029: 1 -1.525,0; 2 1.525,0
LEDSC125X200X120-2_HS = smd 0.94 x 0.99: A -1.045,0; C 1.045,0
LTST-C170EKT = smd 1.2 x 1.2: A -1.05,0; C 1.05,0
1206_LED_REVERSE = smd 0.6 x 2.1: 1 -1.3,0.25; 2 1.3,0.25 | hole 1.55: 0,0
2-56-MOUNTING-HOLE-NO-METAL = hole 2.261: 0,0
HEADER-1X4-BOTTOM-ENTRY = smd 1.5 x 2.1: 1 3.81,-1.85; 2 1.27,1.85; 3 -1.27,-1.85; 4 -3.81,1.85 | hole 1.2: -1.27,0; -3.81,0; 1.27,0; 3.81,0
HDRV10W63P254_10X1_2540X254H838_HS = drill 1.1 pad 1.65 square: 1 0,0 | drill 1.1 pad 1.65: 2 2.54,0; 3 5.08,0; 4 7.62,0; 5 10.16,0; 6 12.7,0; 7 15.24,0; 8 17.78,0; 9 20.32,0; 10 22.86,0
HDRVR4W80P254_1X4_1066X254X850B = drill 1.331 pad 1.997: 1 0,0; 2 2.54,0; 3 5.08,0; 4 7.62,0
2X3-SMD = smd 1 x 3.15: 1 -2.54,-2.54; 2 -2.54,2.54; 3 0,-2.54; 4 0,2.54; 5 2.54,-2.54; 6 2.54,2.54
MOLEX-0532610271 = smd 0.8 x 1.6: 1 -0.637,2.9; 2 0.613,2.9 | smd 2.1 x 3: G1 -3.175,0; G2 3.175,0
SI2302DS = smd 2.05 x 2.9: D -0.875,0 | smd 1.5 x 1: G 1.15,-0.95; S 1.15,0.95
RESC2012X60_HS = smd 0.92 x 1.38: 1 -0.955,0; 2 0.955,0
JS102011SAQN = smd 1.2 x 2.5: A -2.5,2.75; B 2.5,2.75; C 0,2.75 | hole 0.9: -3.4,0; 3.4,0
4.5MM_TACTILE_SWITCH_TL3305AF160QG = smd 1.6 x 1.4: 1 -3.6,-1.5; 2 3.6,-1.5; 3 -3.6,1.5; 4 3.6,1.5
QFN-64 = smd 1.562 x 0.28: 1 -4.881,3.75; 2 -4.881,3.25; 3 -4.881,2.75; 4 -4.881,2.25; 5 -4.881,1.75; 6 -4.881,1.25; 7 -4.881,0.75; 8 -4.881,0.25; 9 -4.881,-0.25; 10 -4.881,-0.75; 11 -4.881,-1.25; 12 -4.881,-1.75; 13 -4.881,-2.25; 14 -4.881,-2.75; 15 -4.881,-3.25; 16 -4.881,-3.75; 33 4.881,-3.75; 34 4.881,-3.25; 35 4.881,-2.75; 36 4.881,-2.25; 37 4.881,-1.75; 38 4.881,-1.25; 39 4.881,-0.75; 40 4.881,-0.25; 41 4.881,0.25; 42 4.881,0.75; 43 4.881,1.25; 44 4.881,1.75; 45 4.881,2.25; 46 4.881,2.75; 47 4.881,3.25; 48 4.881,3.75 | smd 0.28 x 1.562: 17 -3.75,-4.881; 18 -3.25,-4.881; 19 -2.75,-4.881; 20 -2.25,-4.881; 21 -1.75,-4.881; 22 -1.25,-4.881; 23 -0.75,-4.881; 24 -0.25,-4.881; 25 0.25,-4.881; 26 0.75,-4.881; 27 1.25,-4.881; 28 1.75,-4.881; 29 2.25,-4.881; 30 2.75,-4.881; 31 3.25,-4.881; 32 3.75,-4.881; 49 3.75,4.881; 50 3.25,4.881; 51 2.75,4.881; 52 2.25,4.881; 53 1.75,4.881; 54 1.25,4.881; 55 0.75,4.881; 56 0.25,4.881; 57 -0.25,4.881; 58 -0.75,4.881; 59 -1.25,4.881; 60 -1.75,4.881; 61 -2.25,4.881; 62 -2.75,4.881; 63 -3.25,4.881; 64 -3.75,4.881
LSM9DS1 = smd 0.275 x 0.85: C1 -1.075,1.475; CAP 0.215,1.475; CS_A/G -1.075,-1.475; CS_M -0.645,-1.475; DEN_A/G 1.505,-1.475; DRDY_M -0.215,-1.475; GND1 1.075,1.475; GND2 0.645,1.475; INT1_A/G 0.645,-1.475; INT2_A/G 1.075,-1.475; INT_M 0.215,-1.475; RES5 1.505,1.475; SDO_M -1.505,-1.475; VDD1 -0.215,1.475; VDD2 -0.645,1.475; VDDIO1 -1.505,1.475 | smd 0.85 x 0.275: RES1 1.725,-0.645; RES2 1.725,-0.215; RES3 1.725,0.215; RES4 1.725,0.645; SCL/SPC -1.725,0.645; SDA/SDI/SDO -1.725,-0.215; SDO_A/G -1.725,-0.645; VDDIO2 -1.725,0.215
SOT23-DBV = smd 0.55 x 1.2: 1 -0.95,-1.3; 2 0,-1.3; 3 0.95,-1.3; 4 0.95,1.3; 5 -0.95,1.3
CRYSTAL-SMD-5X3 = smd 1.9 x 1.1: 1 -1.85,-1.15; 2 1.85,-1.15; 3 1.85,1.15; 4 -1.85,1.15

### Placement (x,y rotation side)
A1  98.06,68.26 168 top
B1  93.06,67.56 180 top
B2  52.56,56.56 0 top
BRID1  59.56,51.06 180 top
C1  93.06,72.06 270 top
C2  90.06,58.56 270 top
C3  81.06,76.56 90 top
C4  89.06,53.56 270 top
C5  81.06,53.56 270 top
C6  96.06,67.46 270 top
C7  89.06,76.56 90 top
C8  76.06,71.56 180 top
C9  60.06,53.06 0 top
C10  58.56,60.06 180 top
C11  64.06,55.56 270 top
C12  65.06,70.56 90 top
C13  70.56,63.56 0 top
C14  68.06,70.56 90 top
C15  70.56,66.56 0 top
C16  62.06,70.56 90 top
C17  46.06,60.06 180 top
C18  50.06,78.06 270 top
D1  97.06,87.56 180 top
D2  92.06,42.06 90 top
D3  33.06,87.56 180 top
D4  33.06,42.56 0 top
D5  97.06,81.06 90 top
D6  94.06,82.06 90 top
D7  59.06,48.06 270 top
D8  74.06,78.06 90 top
D9  56.06,78.06 90 top
D14  72.06,48.06 270 top
D15  28.56,47.06 270 top
D16  101.56,41.56 90 top
D21  101.56,83.06 90 top
D22  27.56,82.06 270 top
DEC1  65.06,65.06 0 top
DECO1  66.06,116.06 0 top
DECO2  37.56,54.06 0 top
H1  85.06,76.56 0 top
H2  45.06,53.56 0 top
H3  85.06,53.56 0 top
H4  45.06,76.56 0 top
J1  46.06,84.56 180 top
J2  54.06,83.06 0 top
J3  57.06,73.06 270 top
J4  49.06,69.06 270 top
M1  97.06,94.06 180 top
M2  97.06,36.06 0 top
M3  33.06,36.06 0 top
M4  33.06,94.06 180 top
P1  122.06,122.06 0 top
P2  122.06,8.06 0 top
P3  8.06,8.06 0 top
P4  8.06,122.06 0 top
Q1  91.56,89.06 270 top
Q2  96.56,43.06 90 top
Q3  38.56,41.06 90 top
Q4  33.06,83.06 270 top
Q6  67.06,78.06 270 top
Q8  76.06,48.06 90 top
Q9  29.06,55.06 0 top
Q12  33.06,78.06 0 top
R1  87.56,88.56 270 top
R2  91.56,46.56 0 top
R3  37.06,83.06 90 top
R4  40.06,46.06 270 top
R5  91.06,82.06 270 top
R6  93.06,77.56 180 top
R7  42.06,69.06 90 top
R8  70.06,55.56 90 top
R9  62.06,75.56 90 top
R10  60.56,65.56 90 top
R11  77.06,58.56 270 top
R12  29.06,59.06 0 top
R14  71.06,78.06 90 top
R15  80.06,58.56 270 top
R17  73.06,55.56 90 top
R18  67.06,55.56 90 top
R19  87.56,42.06 180 top
R20  77.06,78.06 90 top
R21  53.06,78.06 90 top
R22  29.06,51.06 0 top
R26  101.56,79.06 0 top
R27  33.06,74.06 0 top
R28  28.06,78.06 0 top
S1  65.56,45.06 0 top
SW1  27.56,68.56 90 top
U1  85.06,67.56 180 top
U2  65.06,65.06 0 top
VR1  60.06,56.56 270 top
Y1  85.06,58.56 0 top

### Tracks (layer width: path | path; a pad name or v marks a point on that pad's centre or on a via)
2V5  (via drill 0.2, 0.35)
  Top 0.254: v68.5,66.56 C15.1 | C7.1 v89.06,74.5 | R9.2 v62.06,77.66 | R10.2 v60.56,67.66 | C11.1 v64.06,58.22 | v68.06,68.5 C14.1 68.06,69.81 | C13.1 v68.5,63.56 | v62.61,58.01 61.86,58.01 VR1.5 | 63.56,63.56 U2.SDO_M 63.61,63.52 63.61,63.09 63.96,62.75 v63.96,62.66 | 63.56,66.56 U2.VDDIO1 62.88,66.53 v62.86,66.56 | 66.56,63.56 U2.DEN_A/G v66.56,62.66 | C8.1 v78.12,71.56 | U2.CS_A/G 63.98,62.68 v63.96,62.66 | U2.CS_M 64.35,63.52 64.35,63.09 63.96,62.7 v63.96,62.66 | U2.VDD1 64.84,67.27 v64.66,67.46 64.41,67.21 U2.VDD2 | U1.54 83.81,64.01 v83.76,64.06 | U1.44 81.51,65.81 v81.56,65.76 | U1.34 81.51,70.81 v81.56,70.76 | U1.23 85.81,71.21 v85.86,71.16 | U1.59 86.31,63.6 85.65,64.26 85.62,64.26 v85.56,64.32 | U2.VDDIO2 62.79,65.26 v62.36,65.26 | U2.SDO_A/G 62.73,64.41 62.71,64.4 62.6,64.4 v62.36,64.16 | J2.10 76.92,82.42 75.36,80.86 v75.36,78.76 | R7.2 44.31,70.01 v44.36,70.06 | C10.1 59.55,60.16 v60.46,60.16
  Bottom 0.254: v75.36,78.76 v75.36,75.46 | v62.06,77.66 59.97,75.56 59.55,75.56 59.25,75.27 59.25,75.25 J3.1
  pour Route15: 83.07,57.13 83.1,57.12 90.09,50.13 92.23,50.13 94.96,61.98 89.54,61.98 89.51,61.99 89.49,62.01 89.48,62.04 89.48,74.57 89.49,74.6 89.51,74.62 89.54,74.63 95.07,74.63 95.1,74.62 95.12,74.6 95.13,74.57 95.13,71.13 107.03,71.13 110.87,74.98 100.04,74.98 100.01,74.99 97.03,77.98 80.09,77.98 78.1,75.99 78.07,75.98 49.09,75.98 44.13,71.03 44.13,69.09 50.09,63.13 57.07,63.13 57.1,63.12 63.09,57.13
ANTENNA
  Top 0.127: B1.1 94.12,68.36 94.12,68.35
  Top 1.27: A1.FEED 97.96,68.36 C6.1 94.12,68.35 94.02,68.46
BAT_GND  (via drill 0.61)
  Top 0.762: S1.A v63.06,49.67 | Q2.S v95.61,45.57 | Q1.S v92.51,86.55 | R15.2 79.46,57 v79.46,55.4 | Q3.S v37.61,43.57 | M3.G1 v29.88,33.95 | M3.G2 v36.23,33.95 | v43.24,60.06 C17.2 | M1.G1 v100.23,96.17 | M1.G2 v93.88,96.17 | M4.G1 v36.23,96.17 | M4.G2 v29.88,96.17 | M2.G1 v93.88,33.95 | M2.G2 v100.23,33.95 | BRID1.1 v60.76,51.06 | B2.G3 54.31,56.11 v54.26,56.06 | C9.2 60.95,53.66 v60.26,54.36 | VR1.2 v60.06,56.56 | B2.G 51.56,59.37 B2.2 | B2.G2 50.71,56.11 v50.76,56.06 | Q4.S 34.41,81.51 v34.41,80.53
  pour Route2: 97.07,79.13 97.1,79.12 100.09,76.13 115.03,76.13 115.98,77.09 115.98,97.98 15.13,97.98 15.13,42.09 25.09,32.13 118.87,32.13 105.03,45.98 93.04,45.98 93.01,45.99 83.03,55.98 63.04,55.98 63.01,55.99 57.03,61.98 50.04,61.98 50.01,61.99 42.99,69.01 42.98,69.04 42.98,71.07 42.99,71.1 49.01,77.12 49.04,77.13 78.03,77.13 80.01,79.12 80.04,79.13
GND  (via drill 0.35)
  Top 0.254: U1.10 89.91,68.28 89.06,68.28 88.88,68.1 88.88,67.01 89.06,66.83 89.91,66.83 U1.7 89.96,66.78 91.31,66.78 92.12,65.98 92.7,65.98 | U1.10 89.91,68.33 89.06,68.33 88.93,68.46 88.93,68.65 89.06,68.78 89.91,68.78 U1.11 | U1.10 89.96,68.33 90.85,68.33 92.07,69.55 92.07,71.67 93.06,72.66 C1.1 | 92.7,65.98 92.86,66.14 92.86,66.56 B1.5 | C6.2 95.37,65.98 92.7,65.98 | C5.2 81.06,52.95 80.07,53.94 80.07,54.96 81.98,56.87 81.98,60.37 82.14,60.54 83.06,60.54 84.28,61.76 84.28,62.65 U1.55 84.33,62.7 84.33,63.55 84.51,63.74 85.6,63.74 85.78,63.55 85.78,62.7 U1.58 85.83,62.65 85.83,61.76 87.06,60.54 87.97,60.54 88.96,59.55 88.96,55.66 89.34,55.27 89.74,55.27 90.05,54.96 90.05,53.94 89.06,52.95 C4.2 | J4.6 v53.63,66.52
  pour Route2: 83.07,57.13 83.1,57.12 90.09,50.13 92.23,50.13 94.98,62.07 94.98,69.07 94.99,69.1 97.01,71.12 97.04,71.13 107.03,71.13 110.87,74.98 100.04,74.98 100.01,74.99 97.03,77.98 80.09,77.98 78.1,75.99 78.07,75.98 49.09,75.98 44.13,71.03 44.13,69.09 50.09,63.13 57.07,63.13 57.1,63.12 63.09,57.13
  pour Bottom: 95.12,74.6 95.13,74.57 95.13,71.13 109.98,71.13 109.98,97.98 15.13,97.98 15.13,42.09 25.09,32.13 105.98,32.13 105.98,45.03 105.03,45.98 95.04,45.98 95.01,45.99 92.01,49 92,49 92,49.01 91.99,49.01 91.99,49.02 91.98,49.03 91.98,49.04 91.98,49.04 91.98,49.05 91.98,49.06 91.98,49.07 91.98,49.07 91.98,49.08 94.96,61.98 89.54,61.98 89.51,61.99 89.49,62.01 89.48,62.04 89.48,74.57 89.49,74.6 89.51,74.62 89.54,74.63 95.07,74.63 95.1,74.62
  pour Top: 94.99,65.1 96.08,66.19 96.08,70.17 96.09,70.2 97.01,71.12 97.04,71.13 109.98,71.13 109.98,97.98 15.13,97.98 15.13,42.09 25.09,32.13 105.98,32.13 105.98,45.03 105.03,45.98 95.04,45.98 95.01,45.99 92.01,49 92,49 92,49.01 91.99,49.01 91.99,49.02 91.98,49.03 91.98,49.04 91.98,49.04 91.98,49.05 91.98,49.06 91.98,49.07 91.98,49.07 91.98,49.08 94.98,62.07 94.98,65.07
MISO
  Top 0.127: J4.1 46.56,71.81 48.31,71.81 50.81,74.31 57.81,74.31 58.66,73.45 68.43,73.45 73.57,68.31 U1.39
MOSI
  Top 0.127: J4.4 50.06,69.06 49.06,70.06 45.68,70.06 44.73,71.01 44.73,72.48 46.96,74.71 58.34,74.71 59.32,73.73 68.54,73.73 73.47,68.81 U1.38
N$1
  Top 0.762: D2.2 92.06,42.31 96.56,42.31 Q2.D 96.56,41.81 97.81,41.81 97.81,39.06 M2.2
N$2
  Top 0.762: 94.06,88.81 93.06,89.81 91.56,89.81 Q1.D | 94.06,88.81 95.31,87.56 D1.2 | 94.06,88.81 96.31,91.06 M1.2
N$3
  Top 0.762: 36.06,41.31 37.06,40.31 38.56,40.31 Q3.D | 36.06,41.31 34.81,42.56 D4.2 | 36.06,41.31 33.81,39.06 M3.2
N$4
  Top 0.762: Q4.D 33.06,84.06 31.56,84.06 31.56,87.56 D3.2 32.31,87.56 32.31,89.76 32.31,91.06 M4.2
N$5
  Top 0.127: D6.A 94.06,81.06 92.06,83.06 91.06,83.06 R5.1
N$6
  Top 0.127: C18.1 50.06,82.56 J1.4
N$7
  Top 0.127: C1.2 B1.2
N$8
  Top 0.127: U1.60 86.81,61.41 87.21,61.01 88.61,61.01 90.06,59.56 C2.1
N$9
  Top 0.127: 85.81,73.81 86.31,73.31 U1.22 | C3.1 81.06,75.56 81.51,75.1 84.64,75.1 85.28,74.46 85.28,74.33 85.81,73.81 | U1.21 86.81,73.81 85.81,73.81
N$10
  Top 0.127: U1.56 84.72,62.59 84.72,59.41 83.21,57.9 Y1.1 83.21,56.6 C5.1
N$11
  Top 0.127: U1.57 85.31,61.31 Y1.3 88.26,58.36 88.26,55.25 C4.1
N$13
  Top 0.127: R6.1 94.81,77.56 97.06,79.81 D5.A
N$16
  Top 0.127: U2.CAP 65.31,66.56 65.31,69.56 65.06,69.56 C12.1
N$17
  Top 0.127: D9.C 56.06,79.06 67.06,79.06 Q6.D 67.06,78.81 67.81,78.81 69.06,80.06 73.31,80.06 74.06,79.31 D8.C
N$18
  Top 0.127: R18.1 67.06,54.31 72.06,49.31 D14.A
N$19
  Top 0.127: D8.A 74.06,77.06 77.06,77.06 R20.1
N$20
  Top 0.127: D9.A 56.06,77.06 53.06,77.06 R21.1
N$21  (via drill 0.2)
  Top 0.127: D7.A 59.96,49.11 62.61,51.76 v68.46,51.76 | v69.66,53.16 70.06,53.56 R8.1
  Bottom 0.127: v68.46,51.76 69.66,52.96 v69.66,53.16
N$22
  Top 0.127: U2.C1 63.96,66.56 63.96,67.41 62.06,69.31 C16.1
N$23
  Top 0.127: VR1.3 58.56,55.56 58.56,54.06 57.56,54.06 56.81,53.31 56.81,48.06 60.31,48.06 62.02,46.34 63.75,46.34 63.75,46.35 64.1,46.35 S1.C
N$26  (via drill 0.2)
  Top 0.127: D16.2 99.36,42.86 v99.26,42.76 | v90.76,43.86 88.96,42.06 R19.1
  Bottom 0.127: v99.26,42.76 91.86,42.76 v90.76,43.86
N$27
  Top 0.127: Q8.D 76.06,47.06 72.06,47.06 D14.C 71.11,46.06 59.9,46.06 59.06,46.91 D7.C
N$28  (via drill 0.2)
  Top 0.127: v80.31,60.56 80.31,59.56 80.06,59.56 | 80.06,59.56 R15.1 | 80.06,59.56 78.87,59.56 78.84,59.52 R11.1 | v87.61,64.16 87.61,64.13 88.31,63.44 U1.63
  Bottom 0.127: v80.31,60.56 81.31,60.56 84.49,63.74 85.77,63.74 86.19,64.16 v87.61,64.16
N$34
  Top 0.127: R22.1 28.06,51.06 27.52,50.52 27.52,46.63 28.34,45.81 28.81,45.81 D15.2
N$35  (via drill 0.2)
  Top 0.127: Q9.D 28.31,55.06 28.31,52.31 28.56,52.31 29.06,51.81 29.06,48.56 28.81,48.56 D15.1 29.31,48.86 v40.36,48.86 | D16.1 101.21,40.16 v99.66,40.16
  Bottom 0.127: v99.66,40.16 98.56,39.06 94.86,39.06 87.26,46.66 70.66,46.66 70.21,46.21 43,46.21 v40.36,48.86
N$40  (via drill 0.2)
  Top 0.127: D21.1 99.96,81.76 97.16,84.56 82.46,84.56 v82.36,84.46 | v79.66,86.16 53.76,86.16 v53.46,85.86 | Q12.D 32.26,78.13 v32.26,80.16 31.01,80.16 D22.1
  Bottom 0.127: v82.36,84.46 81.36,84.46 v79.66,86.16 | v53.46,85.86 42.33,85.86 41.38,84.91 41.38,84.28 36.86,79.76 33.73,79.76 33.33,80.16 v32.26,80.16
N$42
  Top 0.127: R26.1 100.81,79.06 102.81,81.06 102.81,84.31 101.31,84.31 D21.2
N$43
  Top 0.127: R28.1 27.06,78.06 27.06,80.56 27.81,80.56 D22.2
PG0
  Top 0.127: U1.14 91.56,70.31 91.56,71.81 92.06,72.31 92.06,77.56 R6.2
PG1
  Top 0.127: R5.2 91.06,70.81 U1.15
PWM1  (via drill 0.2)
  Top 0.127: Q1.G 90.3,87.6 R1.2 85.11,85.16 66.96,85.16 66.76,84.96 J2.6 | v78.66,67.86 78.71,67.81 U1.40
  Bottom 0.127: v78.66,67.86 75.15,67.86 73.16,69.86 73.16,71.83 66.76,78.23 J2.6
PWM2  (via drill 0.2)
  Top 0.127: Q2.G 96.61,44.21 v96.56,44.26 | v93.26,45.36 92.51,46.1 R2.2 91.72,45.77 v91.72,45.36 | v78.66,59.97 v78.66,60.86 | U1.41 78.82,67.31 78.76,67.25 v78.66,67.25
  Bottom 0.127: v96.56,44.26 94.36,44.26 v93.26,45.36 | v78.66,59.97 78.66,52.96 84.68,46.94 90.14,46.94 v91.72,45.36 | v78.66,60.86 v78.66,67.25 v78.66,67.26 75.33,67.26 64.21,78.37 64.21,79.84 64.22,79.85 J2.5
PWM3  (via drill 0.2)
  Top 0.127: Q3.G 39.51,44.55 R4.2 39.31,45.1 v38.96,45.46 | U1.42 78.21,66.81 78.17,66.77 v78.06,66.77
  Bottom 0.127: v38.96,45.46 38.96,73.76 48.26,83.06 52.1,83.06 53.14,82.02 57.03,82.02 58.07,83.06 J2.3 63.93,78.26 75.42,66.77 v78.06,66.77
PWM4  (via drill 0.2)
  Top 0.127: Q4.G 32.91,81.91 v33.06,82.06 | v35.46,82.76 36.71,84.01 R3.2 39.41,84.01 v39.46,84.06 | J2.2 57.86,81.8 v57.86,81.76 | v77.96,66.16 79.23,66.16 79.29,66.22 80.09,66.22 U1.43
  Bottom 0.127: v33.06,82.06 33.76,82.76 v35.46,82.76 | J2.2 55.96,83.7 55.96,83.99 53.64,86.3 41.7,86.3 v39.46,84.06 | v57.86,81.76 58.36,81.26 60.36,81.26 75.46,66.16 v77.96,66.16
PWM5  (via drill 0.2)
  Top 0.127: Q9.G 30.21,54.45 31.17,55.42 31.17,56.6 30.21,57.56 30.21,58.86 R12.2 33.41,62.46 49.86,62.46 v50.26,62.86 | v77.26,62.86 81.13,62.86 U1.49
  Bottom 0.127: v50.26,62.86 50.96,63.56 59.76,63.56 62.46,60.86 75.26,60.86 v77.26,62.86
PWM6
  Top 0.127: 34.06,74.06 34.06,77.06 Q12.G | U1.50 81.81,61.31 59.31,61.31 54.31,66.31 54.31,66.57 52.87,68 43.81,68 42.74,69.07 39.77,69.07 34.78,74.06 34.06,74.06 | 34.06,74.06 R27.2
PWM7
  Top 0.127: 74.06,55.31 76.81,52.56 76.81,49.31 Q8.G | 74.06,55.31 73.06,56.31 R17.2 | U1.51 82.31,61.06 82.06,61.06 81.31,60.31 81.31,58.56 79.56,58.56 78.06,57.06 78.06,55.05 77.34,54.33 76.78,54.33 75.8,55.31 74.06,55.31
PWM8  (via drill 0.2)
  Top 0.127: Q6.G 66.11,75.61 66.46,75.26 69.56,75.26 v69.96,75.66 | v69.66,78.86 69.81,79.01 R14.2 73.35,76.72 73.35,76.59 76.08,73.86 v81.86,73.86 | U1.19 87.72,72.35 87.72,71.59 87.46,71.33 v87.46,70.36
  Bottom 0.127: v69.96,75.66 69.66,75.96 v69.66,78.86 | v81.86,73.86 85.36,70.36 v87.46,70.36
RESET  (via drill 0.2)
  Top 0.127: v48.06,67.56 47.06,66.56 46.56,66.56 J4.5 43.64,66.52 R7.1 38.91,64.96 SW1.1 | v84.31,69.31 U1.12 | C18.2 v50.06,76.18 57.18,76.18 v59.26,78.26 | v71.76,74.66 65.36,74.66 v64.76,75.26
  Bottom 0.127: v48.06,67.56 48.06,74.03 49.04,75.01 49.44,75.01 50.06,75.63 v50.06,76.18 | v84.31,69.31 78.96,74.66 v71.76,74.66 | v64.76,75.26 62.76,77.26 62.76,78.26 v59.26,78.26
RF_N
  Top 0.127: B1.3 92.41,68.06 92.16,67.81 U1.9
RF_P
  Top 0.127: B1.4 92.41,67.06 92.16,67.31 U1.8
RX0  (via drill 0.2)
  Top 0.127: v46.26,79.76 44.79,81.23 J1.2 | U1.46 76.68,64.81 68.39,73.09 59.54,73.09 v59.46,73.01 | v48.56,75.16 48.93,75.16 49.07,75.01 58.67,75.01 v59.5,74.17
  Bottom 0.127: v48.56,75.16 46.26,77.46 v46.26,79.76 | v59.46,73.01 59.46,74.13 v59.5,74.17
SCK
  Top 0.127: U1.37 73.36,69.31 68.29,74.38 63.99,74.38 62.63,75.74 49.61,75.74 49.44,75.9 47.65,75.9 44.45,72.7 44.45,70.89 46.28,69.06 J4.3
SCL  (via drill 0.2)
  Top 0.127: v64.66,79.66 64.66,80.46 64.86,80.66 69.43,80.66 70.87,82.1 70.88,82.1 J2.8 | v64.66,78.56 64.66,76.76 v63.56,75.66 | v63.16,74.56 62.1,74.56 R9.1 61.71,74.26 v60.66,74.26 | U1.25 84.81,74.11 v84.74,74.18 | U2.SCL/SPC 62.64,65.7 62.57,65.77 59.26,65.77 J3.3
  Bottom 0.127: v64.66,79.66 v64.66,78.56 | v63.56,75.66 63.56,74.96 v63.16,74.56 | J3.3 57.06,68.8 58.27,70.01 58.27,71.04 59.9,72.67 59.9,73.5 v60.66,74.26 | v84.74,74.18 84.7,74.21 82.13,74.21 82.04,74.3 80.59,74.3 J2.8
SDA  (via drill 0.2)
  Top 0.127: 60.56,64.81 R10.1 | 60.56,64.81 59.94,65.42 59.22,65.42 59.2,65.44 J3.4 | v84.16,74.66 84.29,74.52 84.29,73.99 84.31,73.98 U1.26 | J2.9 72.98,81.66 v71.06,81.66 | v67.86,81.66 61.96,81.66 v61.86,81.56 | v62.36,80.66 61.36,79.66 v59.66,79.66 | 60.56,64.81 62.07,64.81 62.14,64.74 62.57,64.74 62.64,64.81 63.3,64.81 U2.SDA/SDI/SDO
  Bottom 0.127: J2.9 74.38,80.94 80.66,74.66 v84.16,74.66 | v71.06,81.66 v67.86,81.66 | v61.86,81.56 62.36,81.06 v62.36,80.66 | v59.66,79.66 57.06,77.06 57.06,74.77 55.84,73.56 55.84,67.47 57.06,66.26 J3.4
TX0  (via drill 0.2)
  Top 0.127: U1.47 80.09,64.39 76.69,64.39 68.28,72.81 59.89,72.81 59.64,72.56 59.05,72.56 v58.71,72.91 | v59.76,75.06 59.36,75.46 v49.26,75.46 | v47.26,80.66 46.16,81.76 v46.16,82.16 | v43.46,84.06 43.11,84.4 43.11,84.91 42.25,85.78 J1.1
  Bottom 0.127: v58.71,72.91 58.71,74.01 v59.76,75.06 | v49.26,75.46 47.26,77.46 v47.26,80.66 | v46.16,82.16 45.36,82.16 v43.46,84.06
VBAT  (via drill 0.61)
  Top 0.762: v65.76,55.41 65.96,55.41 R18.2 67.31,56.56 69.81,56.56 R8.2 71.16,55.41 v71.46,55.41 | R26.2 v103.81,79.06 | R22.2 v31.31,51.06 | R11.2 v77.06,55.5 | R28.2 v30.31,78.06 | D4.1 v30.41,42.56 | D3.1 v35.71,87.56 | R20.2 v77.06,80.31 | M3.1 v32.42,40.37 | v57.84,53.06 C9.1 | R21.2 v53.06,80.31 | M4.1 v33.69,89.75 | D2.1 v92.06,39.41 | v48.87,60.06 C17.1 | D1.1 v99.71,87.56 | VR1.1 v57.55,57.51 | S1.B v68.06,49.67 | v85.3,42.06 R19.2 | M2.1 v96.42,40.37 | M1.1 v97.69,89.75 | B2.P 53.56,59.31 53.81,59.31 B2.1
  pour Route15 (rank 2): 97.07,79.13 97.1,79.12 100.09,76.13 115.03,76.13 115.98,77.09 115.98,97.98 15.13,97.98 15.13,42.09 25.09,32.13 118.87,32.13 105.03,45.98 93.04,45.98 93.01,45.99 83.03,55.98 63.04,55.98 63.01,55.99 57.03,61.98 50.04,61.98 50.01,61.99 42.99,69.01 42.98,69.04 42.98,71.07 42.99,71.1 49.01,77.12 49.04,77.13 78.03,77.13 80.01,79.12 80.04,79.13
(copper drawn outside any net)
  shapes: Route15 area x1, Route2 area x1, Top area x1

### Text on the board
tPlace: O | G | GND | SDA | BAT / GND | P4 | P3 | V / BAT | P2 | P1 | SCL | 2V5 | Y | B | 2V5 | MISO | MOSI | GND | SCL | RESET | GND | SDA | Designed by: / / Michael Shao / Evan Smith | Rev 1 / Feb. 2022
bPlace: O | G | Y | B